# Altium schematic sheet PAGE121.SchDoc
size 246 x 182 mm
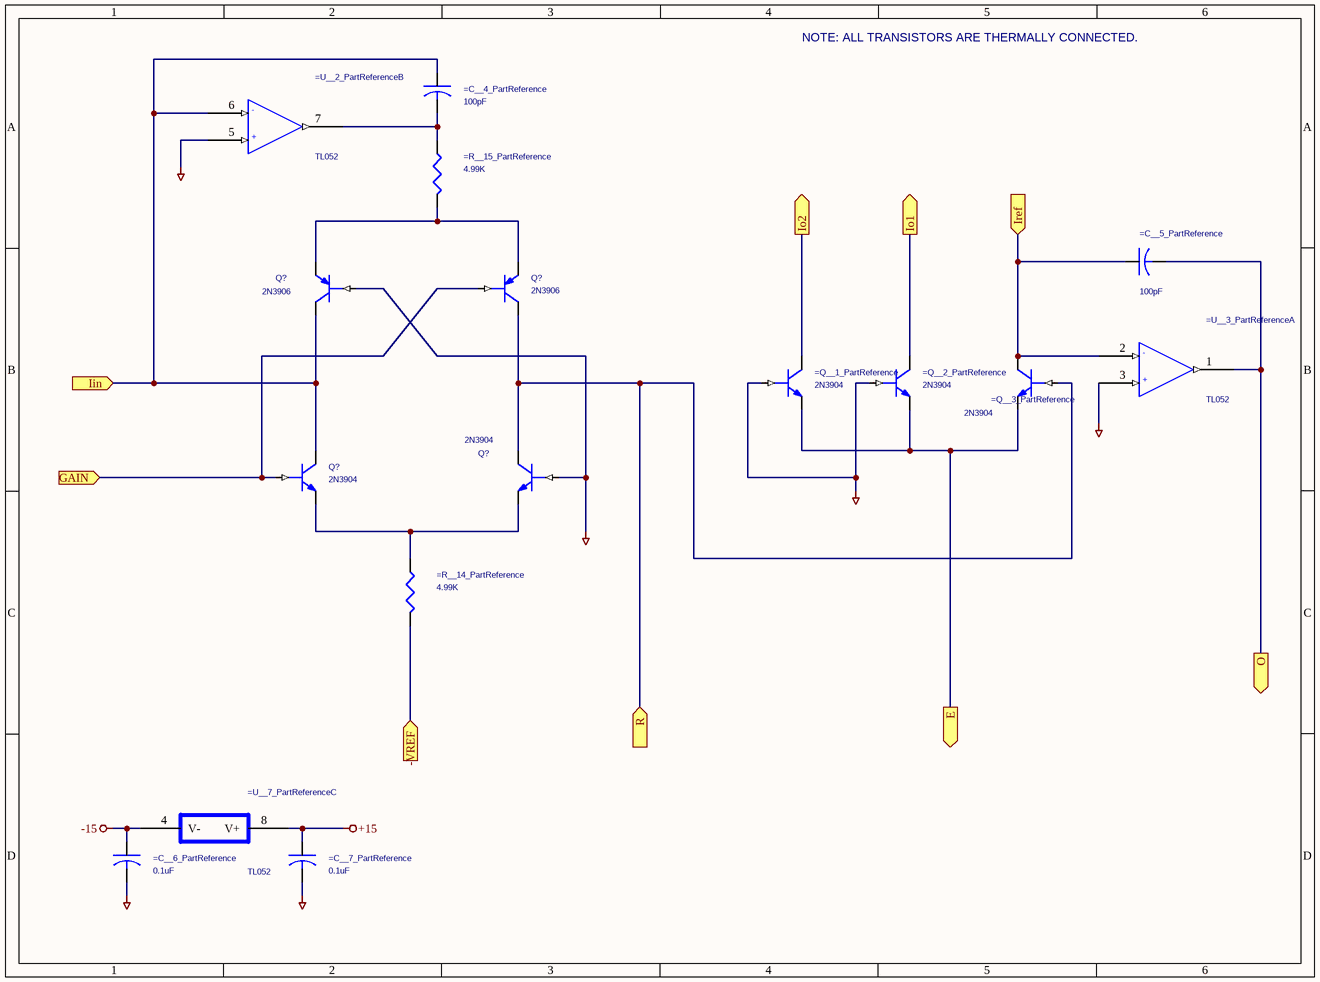
[diagram p0: PAGE121.SchDoc]

## Parts
(Parts that share a designator on the sheet are numbered #1, #2 ... from top to bottom, then left to right.)
=C__4_PartReference  100pF  [RAD0.1]
=C__5_PartReference  100pF  [RAD0.1]
=C__6_PartReference  0.1uF  [AXIALCAP0.3]
=C__7_PartReference  0.1uF  [AXIALCAP0.3]
=Q__1_PartReference  2N3904  [TO92]
=Q__2_PartReference  2N3904  [TO92]
=Q__3_PartReference  2N3904  [TO92]
=R__14_PartReference  4.99K  [AXIAL0.4]
=R__15_PartReference  4.99K  [AXIAL0.4]
=U__2_PartReference  TL052  [DIP8]  (part B of 3)
=U__3_PartReference  TL052  [DIP8]  (part A of 3)
=U__7_PartReference  TL052  [DIP8]  (part C of 3)
Q?#1  2N3906  [TO92]
Q?#2  2N3906  [TO92]
Q?#3  2N3904  [TO92]
Q?#4  2N3904  [TO92]

## Ports
-VREF (in), E (out), GAIN (in), Iin (in), Io1 (out), Io2 (out), Iref (in), O (out), R (in)

## Nets
+15: =C__7_PartReference.1 =U__7_PartReference.8(V+)
-15: =C__6_PartReference.1 =U__7_PartReference.4(V-)
AGND: =C__6_PartReference.2 =C__7_PartReference.2 =Q__1_PartReference.BASE =Q__2_PartReference.BASE =U__2_PartReference.5(+) =U__3_PartReference.3(+) Q?#1.BASE Q?#4.BASE
-VREF: =R__14_PartReference.2 ; port -VREF
E: =Q__1_PartReference.EMITTER =Q__2_PartReference.EMITTER =Q__3_PartReference.EMITTER ; port E
GAIN: Q?#2.BASE Q?#3.BASE ; port GAIN
Iin: =C__4_PartReference.1 =U__2_PartReference.6(-) Q?#1.COLLECTOR Q?#3.COLLECTOR ; port Iin
Io1: =Q__2_PartReference.COLLECTOR ; port Io1
Io2: =Q__1_PartReference.COLLECTOR ; port Io2
Iref: =C__5_PartReference.1 =Q__3_PartReference.COLLECTOR =U__3_PartReference.2(-) ; port Iref
O: =C__5_PartReference.2 =U__3_PartReference.1(OUT) ; port O
R: =Q__3_PartReference.BASE Q?#2.COLLECTOR Q?#4.COLLECTOR ; port R
Net=C__4_PartReference_2: =C__4_PartReference.2 =R__15_PartReference.1 =U__2_PartReference.7(OUT)
Net=R__14_PartReference_1: =R__14_PartReference.1 Q?#3.EMITTER Q?#4.EMITTER
Net=R__15_PartReference_2: =R__15_PartReference.2 Q?#1.EMITTER Q?#2.EMITTER

## Notes on the sheet
- NOTE: ALL TRANSISTORS ARE THERMALLY CONNECTED.

## Library data of the parts
=C__4_PartReference =C__5_PartReference =C__6_PartReference =C__7_PartReference = CAP_Dup1
=Q__1_PartReference =Q__2_PartReference =Q__3_PartReference Q?#3 Q?#4 = NPN
=R__14_PartReference =R__15_PartReference = R_Dup1
=U__2_PartReference =U__3_PartReference =U__7_PartReference = GEN DUAL OPAMP-H
  =U__2_PartReference: PACKAGE: =U__2_PACKAGE
  =U__3_PartReference: PACKAGE: =U__3_PACKAGE
  =U__7_PartReference: PACKAGE: =U__7_PACKAGE
Q?#1 Q?#2 = PNP